# Altium schematic sheet Amplifier Board.SchDoc
size A
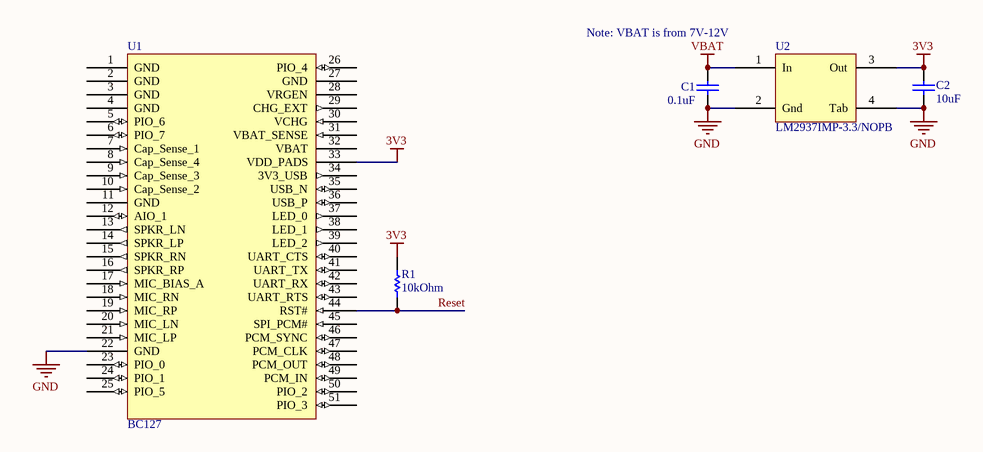
[diagram p0: Amplifier Board.SchDoc]

## Parts
C1  0.1uF  [C1206]
C2  10uF  [C1206]
R1  10kOhm  [RESC0603(1608)_N]
U1  BC127  [BC127]
U2  LM2937IMP-3.3/NOPB  [DSO-G3/C6.4]

## Nets
3V3: C2.2 R1.2 U1.33(VDD_PADS) U2.3(Out)
GND: C1.1 C2.1 U1.22(GND) U2.2(Gnd) U2.4(Tab)
VBAT: C1.2 U2.1(In)
Reset: R1.1 U1.44(RST#)

Not connected (* = marked no-connect by the designer): U1 1(GND) 2(GND) 3(GND) 4(GND) 5(PIO_6) 6(PIO_7) 7(Cap_Sense_1) 8(Cap_Sense_4) 9(Cap_Sense_3) 10(Cap_Sense_2) 11(GND) 12(AIO_1) 13(SPKR_LN) 14(SPKR_LP) 15(SPKR_RN) 16(SPKR_RP) 17(MIC_BIAS_A) 18(MIC_RN) 19(MIC_RP) 20(MIC_LN) 21(MIC_LP) 23(PIO_0) 24(PIO_1) 25(PIO_5) 26(PIO_4) 27(GND) 28(VRGEN) 29(CHG_EXT) 30(VCHG) 31(VBAT_SENSE) 32(VBAT) 34(3V3_USB) 35(USB_N) 36(USB_P) 37(LED_0) 38(LED_1) 39(LED_2) 40(UART_CTS) 41(UART_TX) 42(UART_RX) 43(UART_RTS) 45(SPI_PCM#) 46(PCM_SYNC) 47(PCM_CLK) 48(PCM_OUT) 49(PCM_IN) 50(PIO_2) 51(PIO_3)

## Notes on the sheet
- Note: VBAT is from 7V-12V

## Library data of the parts
C1 = Cap Semi: Regulator Filter Cap; Published: 8-Jun-2000; LatestRevisionDate: 29-May-2009; LatestRevisionNote: IPC-7351 Footprint Added.; PackageReference: C1206; Publisher: Altium Limited; PackageDescription: Chip Capacitor; Value: 0.1uF
C2 = Cap Semi: 1206 Ceramic Capacitor; Published: 8-Jun-2000; LatestRevisionDate: 29-May-2009; LatestRevisionNote: IPC-7351 Footprint Added.; PackageReference: C1206; Publisher: Altium Limited; PackageDescription: Chip Capacitor; Value: 10uF
R1 = CMP-1012-00001-1: 0603 10K Resistor; Case-Metric: 1608; Power: None; Case-EIA: 0603; Technology: SMT; Value: 10kOhm; Tolerance: None
U1 = BC127: Bluetooth Module